# EAGLE design EuroESP32 (EAGLE 9.6.2)
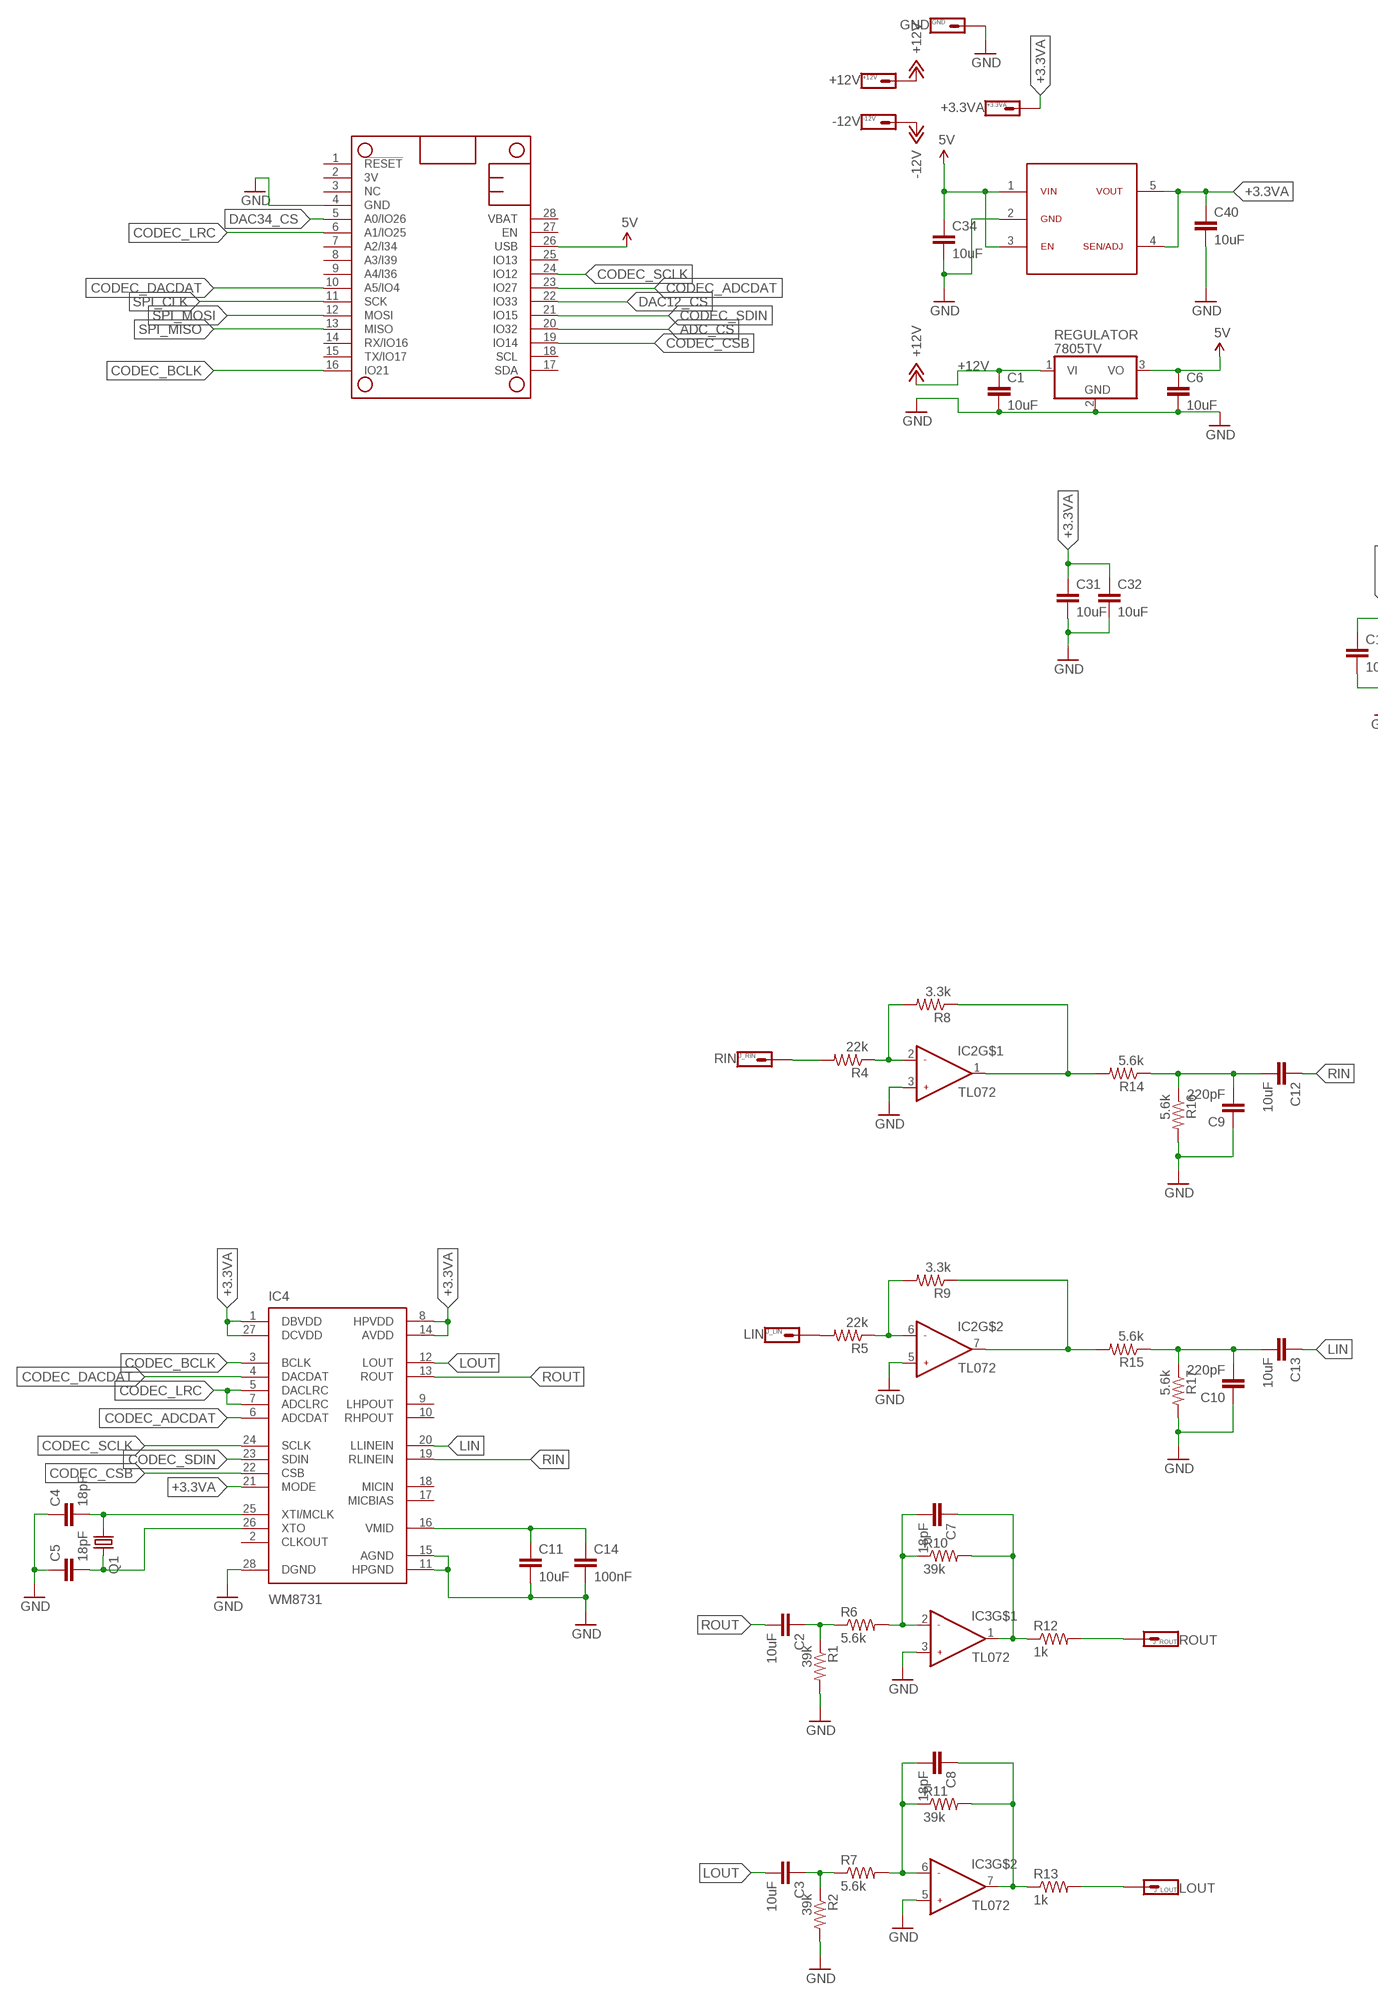
[diagram p0: schematic, sheet 1, part 1 of 2]
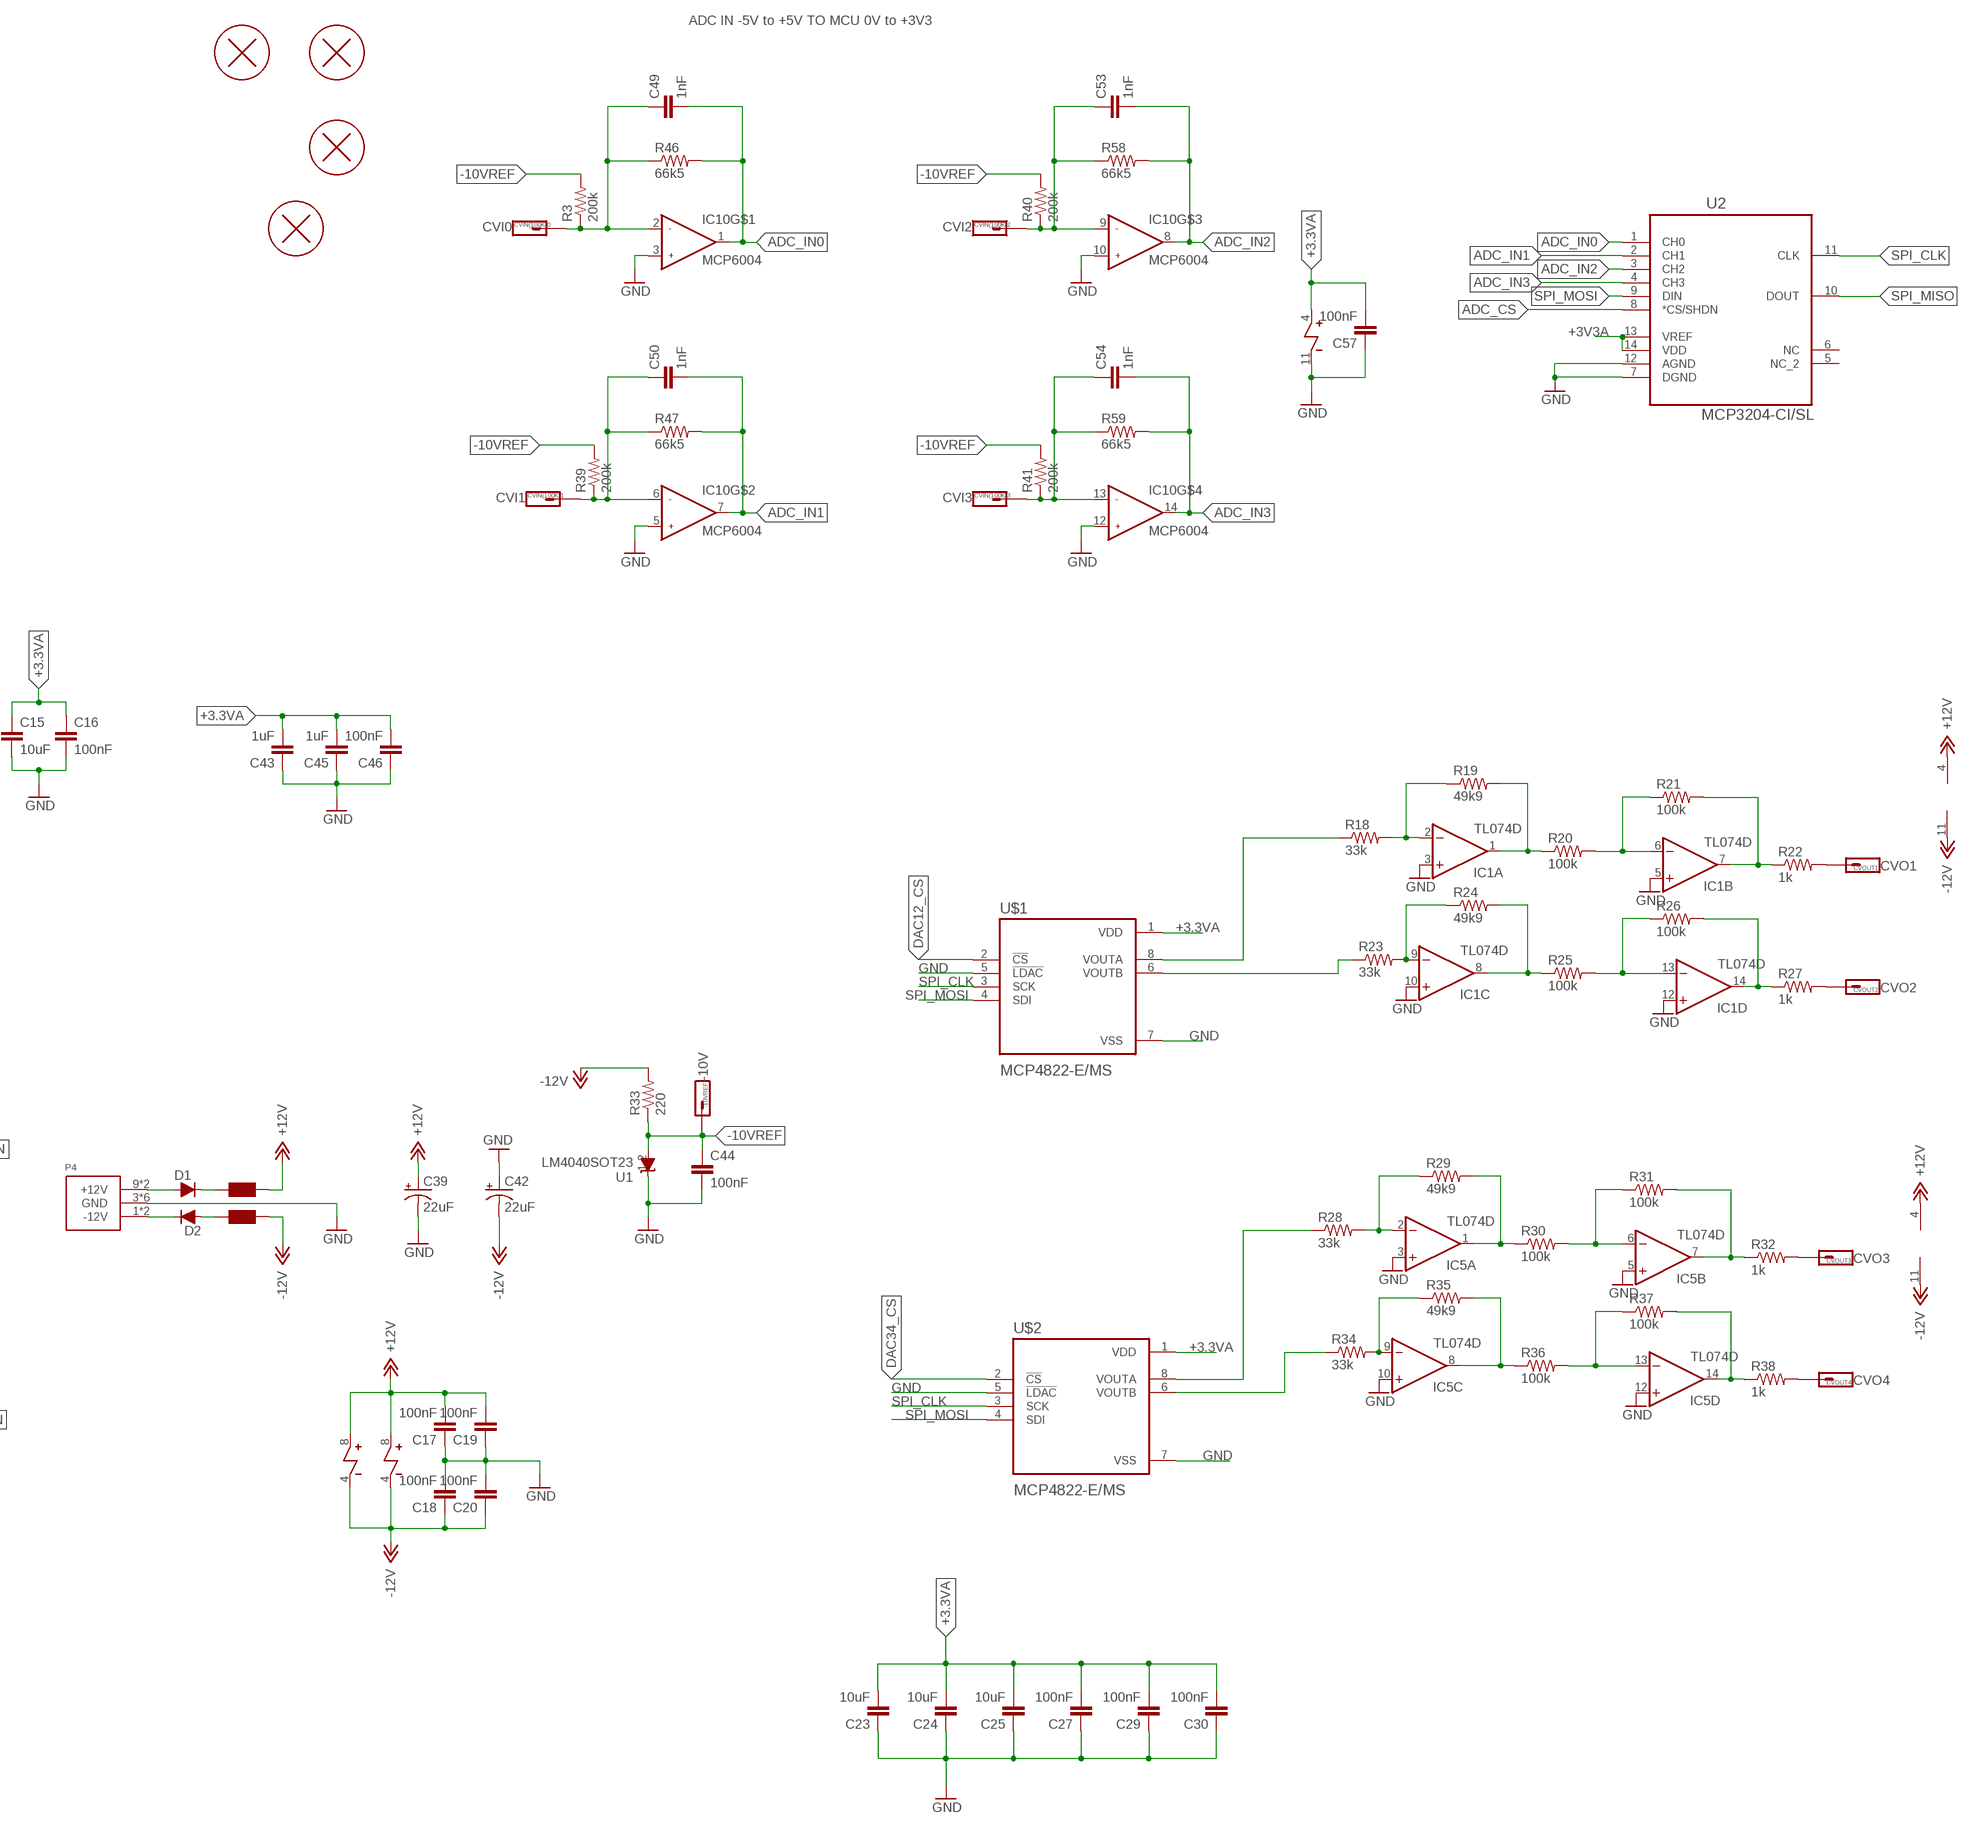
[diagram p1: schematic, sheet 1, part 2 of 2]

## Parts
+3.3VA  +3.3VA  HEADER-1X1  [1X01_SIDE_NAME]
+12V  +12V  HEADER-1X1  [1X01_SIDE_NAME]
-10VREF  -10V  HEADER-1X1  [1X01_SIDE_NAME]
-12V  -12V  HEADER-1X1  [1X01_SIDE_NAME]
C1  10uF  C2.5/2  [C2.5-2]
C2  10uF  CAPACITOR0805  [R0805]
C3  10uF  CAPACITOR0805  [R0805]
C4  18pF  CAPACITOR  [RESISTOR_0603]
C5  18pF  CAPACITOR  [RESISTOR_0603]
C6  10uF  C2.5/2  [C2.5-2]
C7  18pF  CAPACITOR  [RESISTOR_0603]
C8  18pF  CAPACITOR  [RESISTOR_0603]
C9  220pF  CAPACITOR  [RESISTOR_0603]
C10  220pF  CAPACITOR  [RESISTOR_0603]
C11  10uF  CAPACITOR0805  [R0805]
C12  10uF  CAPACITOR0805  [R0805]
C13  10uF  CAPACITOR0805  [R0805]
C14  100nF  CAPACITOR  [RESISTOR_0603]
C15  10uF  CAPACITOR0805  [R0805]
C16  100nF  CAPACITOR  [RESISTOR_0603]
C17  100nF  CAPACITOR  [RESISTOR_0603]
C18  100nF  CAPACITOR  [RESISTOR_0603]
C19  100nF  CAPACITOR  [RESISTOR_0603]
C20  100nF  CAPACITOR  [RESISTOR_0603]
C23  10uF  CAPACITOR0805  [R0805]
C24  10uF  CAPACITOR0805  [R0805]
C25  10uF  CAPACITOR0805  [R0805]
C27  100nF  CAPACITOR  [RESISTOR_0603]
C29  100nF  CAPACITOR  [RESISTOR_0603]
C30  100nF  CAPACITOR  [RESISTOR_0603]
C31  10uF  CAPACITOR0805  [R0805]
C32  10uF  CAPACITOR0805  [R0805]
C34  10uF  CAPACITOR1210  [R1210]
C39  22uF  CAP_POL1206_TANT  [1206_POL]
C40  10uF  CAPACITOR0805  [R0805]
C42  22uF  CAP_POL1206_TANT  [1206_POL]
C43  1uF  CAPACITOR  [RESISTOR_0603]
C44  100nF  CAPACITOR  [RESISTOR_0603]
C45  1uF  CAPACITOR  [RESISTOR_0603]
C46  100nF  CAPACITOR  [RESISTOR_0603]
C49  1nF  CAPACITOR  [RESISTOR_0603]
C50  1nF  CAPACITOR  [RESISTOR_0603]
C53  1nF  CAPACITOR  [RESISTOR_0603]
C54  1nF  CAPACITOR  [RESISTOR_0603]
C57  100nF  CAPACITOR  [RESISTOR_0603]
CVIN(100K)0  CVI0  HEADER-1X1  [1X01_SIDE_NAME]
CVIN(100K)1  CVI1  HEADER-1X1  [1X01_SIDE_NAME]
CVIN(100K)2  CVI2  HEADER-1X1  [1X01_SIDE_NAME]
CVIN(100K)3  CVI3  HEADER-1X1  [1X01_SIDE_NAME]
CVOUT1  CVO1  HEADER-1X1  [1X01_SIDE_NAME]
CVOUT2  CVO2  HEADER-1X1  [1X01_SIDE_NAME]
CVOUT3  CVO3  HEADER-1X1  [1X01_SIDE_NAME]
CVOUT4  CVO4  HEADER-1X1  [1X01_SIDE_NAME]
D1  DIODE  [SOD123]
D2  DIODE  [SOD123]
F1  FERRITE-BEAD0805  [R0805]
F2  FERRITE-BEAD0805  [R0805]
GND  GND  HEADER-1X1  [1X01_SIDE_NAME]
H1  PCB_SCREW  [PCB_SCREW]
H3  PCB_SCREW  [PCB_SCREW]
H4  PCB_SCREW  [PCB_SCREW]
H5  PCB_SCREW  [PCB_SCREW]
IC1  TL074D  [SO14]
IC2  TL072  OPAMP_DUAL  [SOIC8]
IC3  TL072  OPAMP_DUAL  [SOIC8]
IC4  WM8731  [SSOP28]
IC5  TL074D  [SO14]
IC7  ADP7118  [SOT23-5L]
IC10  MCP6004  OPAMP_QUADPWR  [TSSOP14]
J_LIN  LIN  HEADER-1X1  [1X01_SIDE_NAME]
J_LOUT  LOUT  HEADER-1X1  [1X01_SIDE_NAME]
J_RIN  RIN  HEADER-1X1  [1X01_SIDE_NAME]
J_ROUT  ROUT  HEADER-1X1  [1X01_SIDE_NAME]
MS2  FEATHER_HUZZAH32NO_DRILL  [FEATHERWING_NODRILL]
P4  POWER_SIMPLE10  [POWER_10]
Q1  CRYSTAL  [HC49UP]
R1  39k  RESISTOR  [RESISTOR_0603]
R2  39k  RESISTOR  [RESISTOR_0603]
R3  200k  RESISTOR  [RESISTOR_0603]
R4  22k  RESISTOR  [RESISTOR_0603]
R5  22k  RESISTOR  [RESISTOR_0603]
R6  5.6k  RESISTOR  [RESISTOR_0603]
R7  5.6k  RESISTOR  [RESISTOR_0603]
R8  3.3k  RESISTOR  [RESISTOR_0603]
R9  3.3k  RESISTOR  [RESISTOR_0603]
R10  39k  RESISTOR  [RESISTOR_0603]
R11  39k  RESISTOR  [RESISTOR_0603]
R12  1k  RESISTOR  [RESISTOR_0603]
R13  1k  RESISTOR  [RESISTOR_0603]
R14  5.6k  RESISTOR  [RESISTOR_0603]
R15  5.6k  RESISTOR  [RESISTOR_0603]
R16  5.6k  RESISTOR  [RESISTOR_0603]
R17  5.6k  RESISTOR  [RESISTOR_0603]
R18  33k  RESISTOR  [RESISTOR_0603]
R19  49k9  RESISTOR  [RESISTOR_0603]
R20  100k  RESISTOR  [RESISTOR_0603]
R21  100k  RESISTOR  [RESISTOR_0603]
R22  1k  RESISTOR  [RESISTOR_0603]
R23  33k  RESISTOR  [RESISTOR_0603]
R24  49k9  RESISTOR  [RESISTOR_0603]
R25  100k  RESISTOR  [RESISTOR_0603]
R26  100k  RESISTOR  [RESISTOR_0603]
R27  1k  RESISTOR  [RESISTOR_0603]
R28  33k  RESISTOR  [RESISTOR_0603]
R29  49k9  RESISTOR  [RESISTOR_0603]
R30  100k  RESISTOR  [RESISTOR_0603]
R31  100k  RESISTOR  [RESISTOR_0603]
R32  1k  RESISTOR  [RESISTOR_0603]
R33  220  RESISTOR  [RESISTOR_0603]
R34  33k  RESISTOR  [RESISTOR_0603]
R35  49k9  RESISTOR  [RESISTOR_0603]
R36  100k  RESISTOR  [RESISTOR_0603]
R37  100k  RESISTOR  [RESISTOR_0603]
R38  1k  RESISTOR  [RESISTOR_0603]
R39  200k  RESISTOR  [RESISTOR_0603]
R40  200k  RESISTOR  [RESISTOR_0603]
R41  200k  RESISTOR  [RESISTOR_0603]
R46  66k5  RESISTOR  [RESISTOR_0603]
R47  66k5  RESISTOR  [RESISTOR_0603]
R58  66k5  RESISTOR  [RESISTOR_0603]
R59  66k5  RESISTOR  [RESISTOR_0603]
REGULATOR  7805TV  [TO220V]
U1  LM4040SOT23  [SOT23]
U2  MCP3204-CI/SL  [SOIC127P600X175-14N]
U$1  MCP4822-E/MS  [SOP65P490X110-8N]
U$2  MCP4822-E/MS  [SOP65P490X110-8N]

## Nets
5V: C6.1 C34.1 IC7.1 IC7.3 MS2.26(USB) REGULATOR.3(VO)
+3.3VA: +3.3VA.1 C15.1 C16.1 C23.2 C24.2 C25.2 C27.2 C29.2 C30.2 C31.1 C32.1 C40.1 C43.2 C45.2 C46.2 C57.2 IC4.1(DBVDD) IC4.8(HPVDD) IC4.14(AVDD) IC4.21(MODE) IC4.27(DCVDD) IC7.4 IC7.5 IC10.4 U$1.1(VDD) U$2.1(VDD)
+3V3A: U2.13(VREF) U2.14(VDD)
+12V: +12V.1 C1.1 C17.2 C19.2 C39.2(+) F1.1 IC1.4(P:V+) IC2.8 IC3.8 IC5.4(P:V+) REGULATOR.1(VI)
-10VREF: -10VREF.1 C44.1 R3.2 R33.1 R39.2 R40.2 R41.2 U1.2(A)
-12V: -12V.1 C18.1 C20.1 C42.1(-) F2.1 IC1.11(P:V-) IC2.4 IC3.4 IC5.11(P:V-) R33.2
ADC_CS: MS2.20(IO32) U2.8(*CS/SHDN)
ADC_IN0: C49.2 IC10.1 R46.2 U2.1(CH0)
ADC_IN1: C50.2 IC10.7 R47.2 U2.2(CH1)
ADC_IN2: C53.2 IC10.8 R58.2 U2.3(CH2)
ADC_IN3: C54.2 IC10.14 R59.2 U2.4(CH3)
CODEC_ADCDAT: IC4.6(ADCDAT) MS2.23(IO27)
CODEC_BCLK: IC4.3(BCLK) MS2.16(IO21)
CODEC_CSB: IC4.22(CSB) MS2.19(IO14)
CODEC_DACDAT: IC4.4(DACDAT) MS2.10(A5/IO4)
CODEC_LRC: IC4.5(DACLRC) IC4.7(ADCLRC) MS2.6(A1/IO25)
CODEC_SCLK: IC4.24(SCLK) MS2.24(IO12)
CODEC_SDIN: IC4.23(SDIN) MS2.21(IO15)
DAC12_CS: MS2.22(IO33) U$1.2(!CS)
DAC34_CS: MS2.5(A0/IO26) U$2.2(!CS)
DAC_B: R23.1 U$1.6(VOUTB)
DAC_D: R34.1 U$2.6(VOUTB)
GND: C1.2 C4.1 C5.1 C6.2 C9.1 C10.1 C11.2 C14.2 C15.2 C16.2 C17.1 C18.2 C19.1 C20.2 C23.1 C24.1 C25.1 C27.1 C29.1 C30.1 C31.2 C32.2 C34.2 C39.1(-) C40.2 C42.2(+) C43.1 C44.2 C45.1 C46.1 C57.1 GND.1 IC1.3(A:+IN) IC1.5(B:+IN) IC1.10(C:+IN) IC1.12(D:+IN) IC2.3 IC2.5 IC3.3 IC3.5 IC4.11(HPGND) IC4.15(AGND) IC4.28(DGND) IC5.3(A:+IN) IC5.5(B:+IN) IC5.10(C:+IN) IC5.12(D:+IN) IC7.2 IC10.3 IC10.5 IC10.10 IC10.11 IC10.12 MS2.4(GND) P4.3(GND) P4.4(GND) P4.5(GND) P4.6(GND) P4.7(GND) P4.8(GND) R1.2 R2.2 R16.2 R17.2 REGULATOR.2(GND) U1.1(C) U2.7(DGND) U2.12(AGND) U$1.5(!LDAC) U$1.7(VSS) U$2.5(!LDAC) U$2.7(VSS)
LIN: C13.1 IC4.20(LLINEIN)
LOUT: C3.2 IC4.12(LOUT)
N$1: J_LIN.1 R5.2
N$2: J_LOUT.1 R13.2
N$3: J_ROUT.1 R12.2
N$4: IC1.2(A:-IN) R18.2 R19.1
N$5: IC1.7(B:OUT) R21.2 R22.1
N$6: IC1.9(C:-IN) R23.2 R24.1
N$8: IC1.1(A:OUT) R19.2 R20.1
N$9: IC1.14(D:OUT) R26.2 R27.1
N$10: IC5.6(B:-IN) R30.2 R31.1
N$11: IC1.8(C:OUT) R24.2 R25.1
N$12: IC5.2(A:-IN) R28.2 R29.1
N$13: IC5.7(B:OUT) R31.2 R32.1
N$14: IC5.13(D:-IN) R36.2 R37.1
N$15: C53.1 CVIN(100K)2.1 IC10.9 R40.1 R58.1
N$16: IC5.1(A:OUT) R29.2 R30.1
N$17: C49.1 CVIN(100K)0.1 IC10.2 R3.1 R46.1
N$18: IC5.9(C:-IN) R34.2 R35.1
N$19: C50.1 CVIN(100K)1.1 IC10.6 R39.1 R47.1
N$20: IC5.14(D:OUT) R37.2 R38.1
N$21: C54.1 CVIN(100K)3.1 IC10.13 R41.1 R59.1
N$22: IC1.6(B:-IN) R20.2 R21.1
N$23: IC5.8(C:OUT) R35.2 R36.1
N$24: R18.1 U$1.8(VOUTA)
N$25: CVOUT1.1 R22.2
N$26: R28.1 U$2.8(VOUTA)
N$27: CVOUT2.1 R27.2
N$28: IC1.13(D:-IN) R25.2 R26.1
N$29: CVOUT3.1 R32.2
N$31: J_RIN.1 R4.2
N$32: IC2.2 R4.1 R8.2
N$33: D1.+ P4.9(+12V) P4.10(+12V)
N$34: CVOUT4.1 R38.2
N$36: IC2.1 R8.1 R14.2
N$37: C9.2 C12.2 R14.1 R16.1
N$40: IC2.6 R5.1 R9.2
N$42: IC2.7 R9.1 R15.2
N$43: C5.2 IC4.26(XTO) Q1.2
N$44: C4.2 IC4.25(XTI/MCLK) Q1.1
N$45: C10.2 C13.2 R15.1 R17.1
N$46: C7.1 IC3.1 R10.2 R12.1
N$47: D1.- F1.2
N$48: C7.2 IC3.2 R6.2 R10.1
N$49: C2.1 R1.1 R6.1
N$53: D2.- P4.1(-12V) P4.2(-12V)
N$54: C8.1 IC3.7 R11.2 R13.1
N$55: C8.2 IC3.6 R7.2 R11.1
N$56: C11.1 C14.1 IC4.16(VMID)
N$57: C3.1 R2.1 R7.1
N$59: D2.+ F2.2
RIN: C12.1 IC4.19(RLINEIN)
ROUT: C2.2 IC4.13(ROUT)
SPI_CLK: MS2.11(SCK) U2.11(CLK) U$1.3(SCK) U$2.3(SCK)
SPI_MISO: MS2.13(MISO) U2.10(DOUT)
SPI_MOSI: MS2.12(MOSI) U2.9(DIN) U$1.4(SDI) U$2.4(SDI)
Unconnected: IC4.2(CLKOUT) IC4.9(LHPOUT) IC4.10(RHPOUT) IC4.17(MICBIAS) IC4.18(MICIN) MS2.1(!RESET) MS2.2(3V) MS2.3(NC) MS2.7(A2/I34) MS2.8(A3/I39) MS2.9(A4/I36) MS2.14(RX/IO16) MS2.15(TX/IO17) MS2.17(SDA) MS2.18(SCL) MS2.25(IO13) MS2.27(EN) MS2.28(VBAT) U2.5(NC_2) U2.6(NC)

## Notes on the sheet
- ADC IN -5V to +5V TO MCU 0V to +3V3

## Library data of the parts
+3.3VA +12V -10VREF -12V CVIN(100K)0 CVIN(100K)1-CVIN(100K)3 CVOUT1-CVOUT4 GND J_LIN J_LOUT J_RIN J_ROUT = TOF:HEADER-1X1: Header 1 Standard 1-pin 0.1" header. Use with straight break away headers (SKU : PRT-00116), right angle break away headers (PRT-00553), swiss pins (PRT-00743), machine pins (PRT-00117), and female headers (PRT-00115).
C1 C6 = TOF:C: CAPACITOR naming: grid - package width
C2-C5 C7-C20 C23-C25 C27 C29-C32 C34 C40 C43-C46 C49 C50 C53 C54 C57 = parts_aman:CAPACITOR
C39 C42 = parts_aman:CAP_POL
D1 D2 = parts_aman:DIODE
F1 F2 = parts_aman:FERRITE-BEAD
H1 H3-H5 = parts_aman:PCB_SCREW
IC1 IC5 = linear:TL074: OP AMP
IC2 IC3 = parts_aman:OPAMP_DUAL
IC4 = og-dac:WM8731
IC7 = parts_aman:ADP7118
IC10 = parts_aman:OPAMP_QUAD
MS2 = TOF:FEATHER_HUZZAH32
P4 = parts_aman:POWER_SIMPLE
Q1 = parts_aman:CRYSTAL
R1-R41 R46 R47 R58 R59 = parts_aman:RESISTOR
REGULATOR = linear:78*: Positive VOLTAGE REGULATOR Source: http://cache.national.com/ds/LM/LM78L05.pdf http://www.fairchildsemi.com/ds/LM/LM7805.pdf
U1 = parts_aman:LM4040
U2 = TOF:MCP3204-CI/SL: IC ADC 12BIT 2.7V 4CH SPI; MPN: MCP3204-CI/SL; OC_FARNELL: 1196795; OC_NEWARK: 26M1276; PACKAGE: 14 - SOIC; SUPPLIER: Microchip
U$1 U$2 = TOF:MCP4822-E/MS: Check prices <https://pricing.snapeda.com/parts/MCP4822-E/MS/Microchip%20Technology/view-part?ref=eda>; AVAILABILITY: Warning; DESCRIPTION: 12 Bit Digital to Analog Converter 2 8-MSOP; MF: Microchip Technology; MP: MCP4822-E/MS; PACKAGE: MSOP-8 Microchip; PRICE: None; PURCHASE-URL: https://pricing.snapeda.com/search/part/MCP4822-E/MS/?ref=eda

## Board
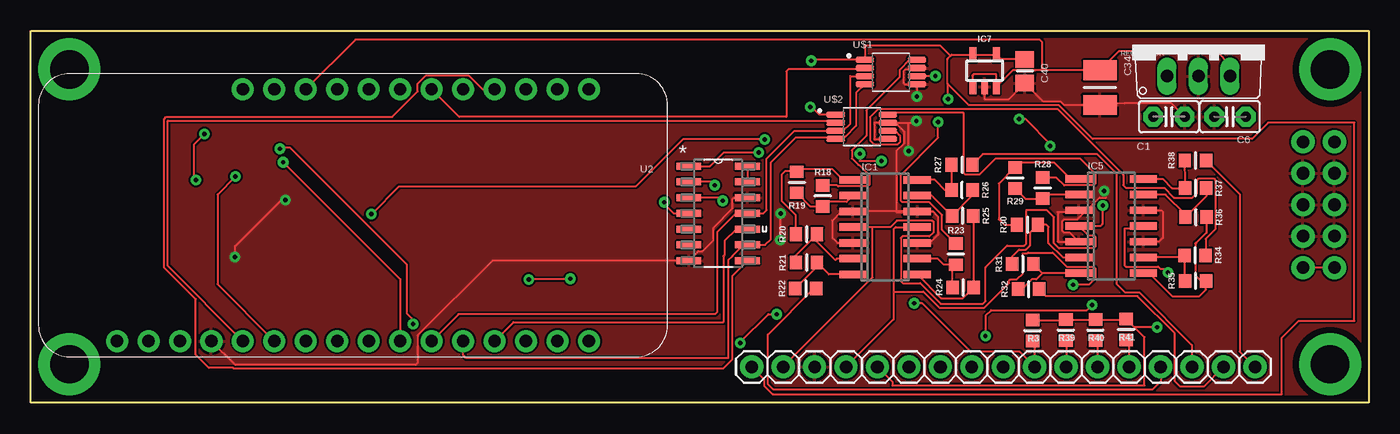
[diagram p2: board, top side]
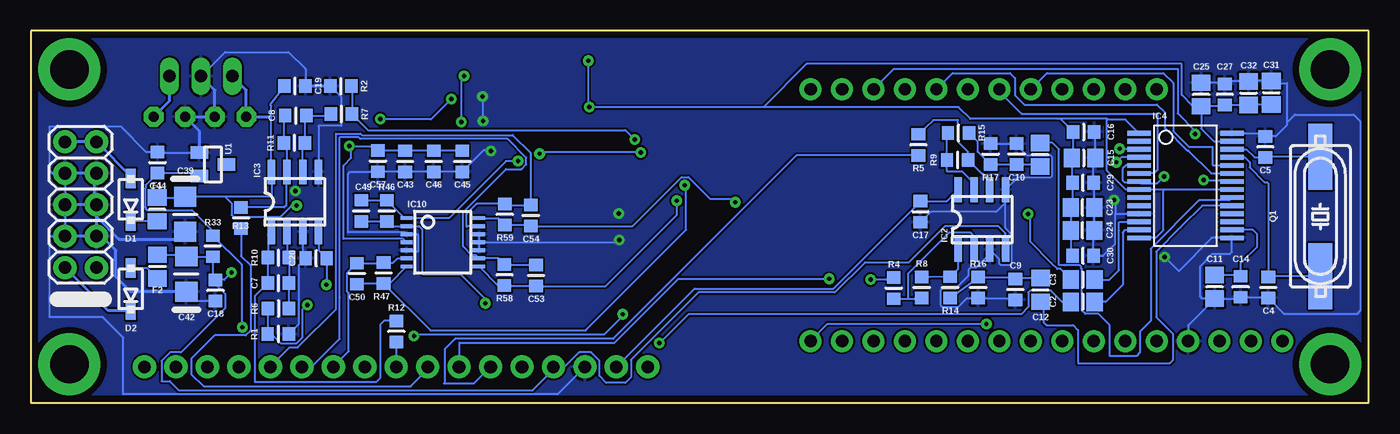
[diagram p3: board, bottom side, seen from below]

Size 108 x 30 mm. Coordinates in mm from the lower left corner, seen from the top.
Outline: 0,0 0,30 108,30 108,0 0,0
Copper layers (1*16): Top 0.035mm / dielectric 1.5mm / Bottom 0.035mm
Design rules "PCBCart-Standard *": minimum track width 6mil, minimum drill 12mil, track to track 6mil, track to pad 6mil, pad to pad 6mil, via to via 6mil, smd to smd 6mil, copper to edge 20mil, drill to drill 8mil, minimum pad ring 8mil, minimum via ring 10mil, stop-mask expansion 3mil, vias tented up to drill 25mil, thermal gap 8mil

### Footprints (pad centres in the part's own frame; a part is rotated, then mirrored left to right if it is on the bottom)
1X01_SIDE_NAME = drill 1.016 pad 1.88: 1 0,0
C2.5-2 = drill 0.813 pad 1.6 octagon: 1 -1.27,0; 2 1.27,0
R0805 = smd 1.3 x 1.5: 1 -0.95,0; 2 0.95,0
RESISTOR_0603 = smd 1 x 1.1: 1 -0.85,0; 2 0.85,0
R1210 = smd 1.6 x 2.7: 1 -1.4,0; 2 1.4,0
1206_POL = smd 1.6 x 1.803: 1 -1.422,0; 2 1.422,0
SOD123 = smd 1.6 x 0.8: + 1.7,0; - -1.7,0
PCB_SCREW = drill 3.1 pad 5: P$1 0,0
SO14 = smd 0.6 x 2.2: 1 -3.81,-2.6; 2 -2.54,-2.6; 3 -1.27,-2.6; 4 0,-2.6; 5 1.27,-2.6; 6 2.54,-2.6; 7 3.81,-2.6; 8 3.81,2.6; 9 2.54,2.6; 10 1.27,2.6; 11 0,2.6; 12 -1.27,2.6; 13 -2.54,2.6; 14 -3.81,2.6
SOIC8 = smd 0.6 x 2: 1 -1.905,-2.419; 2 -0.635,-2.419; 3 0.635,-2.419; 4 1.905,-2.419; 5 1.905,2.42; 6 0.635,2.42; 7 -0.635,2.42; 8 -1.905,2.42
SSOP28 = smd 0.381 x 1.905: 1 -4.55,-3.752; 2 -3.9,-3.752; 3 -3.25,-3.752; 4 -2.6,-3.752; 5 -1.95,-3.752; 6 -1.3,-3.752; 7 -0.65,-3.752; 8 0,-3.752; 9 0.65,-3.752; 10 1.3,-3.752; 11 1.95,-3.752; 12 2.6,-3.752; 13 3.25,-3.752; 14 3.9,-3.752; 15 3.9,3.752; 16 3.25,3.752; 17 2.6,3.752; 18 1.95,3.752; 19 1.3,3.752; 20 0.65,3.752; 21 0,3.752; 22 -0.65,3.752; 23 -1.3,3.752; 24 -1.95,3.752; 25 -2.6,3.752; 26 -3.25,3.752; 27 -3.9,3.752; 28 -4.55,3.752
SOT23-5L = smd 0.55 x 1.2: 1 -0.95,-1.3; 2 0,-1.3; 3 0.95,-1.3; 4 0.95,1.3; 5 -0.95,1.3
TSSOP14 = smd 0.305 x 0.991: 1 -1.95,-2.918; 2 -1.3,-2.918; 3 -0.65,-2.918; 4 0,-2.918; 5 0.65,-2.918; 6 1.3,-2.918; 7 1.95,-2.918; 8 1.95,2.918; 9 1.3,2.918; 10 0.65,2.918; 11 0,2.918; 12 -0.65,2.918; 13 -1.3,2.918; 14 -1.95,2.918
FEATHERWING_NODRILL = drill 1 pad 1.778: 1 6.35,1.27; 2 8.89,1.27; 3 11.43,1.27; 4 13.97,1.27; 5 16.51,1.27; 6 19.05,1.27; 7 21.59,1.27; 8 24.13,1.27; 9 26.67,1.27; 10 29.21,1.27; 11 31.75,1.27; 12 34.29,1.27; 13 36.83,1.27; 14 39.37,1.27; 15 41.91,1.27; 16 44.45,1.27; 17 44.45,21.59; 18 41.91,21.59; 19 39.37,21.59; 20 36.83,21.59; 21 34.29,21.59; 22 31.75,21.59; 23 29.21,21.59; 24 26.67,21.59; 25 24.13,21.59; 26 21.59,21.59; 27 19.05,21.59; 28 16.51,21.59
POWER_10 = drill 1.016 pad 1.88: 1 -5.08,-1.27; 2 -5.08,1.27; 3 -2.54,-1.27; 4 -2.54,1.27; 5 0,-1.27; 6 0,1.27; 7 2.54,-1.27; 8 2.54,1.27; 9 5.08,-1.27; 10 5.08,1.27
HC49UP = smd 5.334 x 1.93: 1 -4.826,0; 2 4.826,0
TO220V = drill 1.016 long: 1 -2.54,-2.54; 2 0,-2.54; 3 2.54,-2.54
SOT23 = smd 1 x 1.4: 1 -0.95,-1.1; 2 0.95,-1.1; 3 0,1.1
SOIC127P600X175-14N = smd 1.981 x 0.559: 1 -2.362,3.81; 2 -2.362,2.54; 3 -2.362,1.27; 4 -2.362,0; 5 -2.362,-1.27; 6 -2.362,-2.54; 7 -2.362,-3.81; 8 2.362,-3.81; 9 2.362,-2.54; 10 2.362,-1.27; 11 2.362,0; 12 2.362,1.27; 13 2.362,2.54; 14 2.362,3.81
SOP65P490X110-8N = smd 1.5 x 0.49: 1 -2.105,0.975; 2 -2.105,0.325; 3 -2.105,-0.325; 4 -2.105,-0.975; 5 2.105,-0.975; 6 2.105,-0.325; 7 2.105,0.325; 8 2.105,0.975

### Placement (x,y rotation side)
+3.3VA  58.19,2.89 90 top
+12V  60.73,2.89 90 top
-10VREF  68.35,2.89 90 top
-12V  65.81,2.89 90 top
C1  91.88,23.08 0 top
C2  23.07,8.14 0 bottom
C3  23.07,9.93 0 bottom
C4  8.1,9.3 90 bottom
C5  8.34,20.64 270 bottom
C6  96.81,23.08 180 top
C7  88.03,9.65 0 bottom
C8  86.62,23.16 0 bottom
C9  28.52,9.14 90 bottom
C10  28.42,20.06 270 bottom
C11  12.43,9.36 270 bottom
C12  26.49,9.11 90 bottom
C13  26.51,20.01 270 bottom
C14  10.32,9.36 270 bottom
C15  23,19.75 0 bottom
C16  23,21.85 0 bottom
C17  36.18,15.41 90 bottom
C18  93.11,9.06 270 bottom
C19  86.68,25.55 180 bottom
C20  84.97,11.65 180 bottom
C23  23.1,15.75 180 bottom
C24  23.1,13.91 180 bottom
C25  13.51,24.88 270 bottom
C27  11.61,24.88 270 bottom
C29  23.05,17.75 180 bottom
C30  23.05,11.86 180 bottom
C31  7.86,25.02 90 bottom
C32  9.69,24.98 90 bottom
C34  86.32,25.43 270 top
C39  95.55,15.21 90 bottom
C40  80.25,26.75 270 top
C42  95.45,10.38 270 bottom
C43  77.79,19.48 90 bottom
C44  97.78,19.38 90 bottom
C45  73.18,19.48 90 bottom
C46  75.48,19.48 90 bottom
C49  81.33,15.49 90 bottom
C50  81.68,10.41 270 bottom
C53  67.21,10.26 270 bottom
C54  67.64,15.09 270 bottom
C57  80,19.49 90 bottom
CVIN(100K)0  81.05,2.89 90 top
CVIN(100K)1  83.59,2.89 90 top
CVIN(100K)2  86.13,2.89 90 top
CVIN(100K)3  88.67,2.89 90 top
CVOUT1  91.21,2.89 90 top
CVOUT2  93.75,2.89 90 top
CVOUT3  96.29,2.89 90 top
CVOUT4  98.83,2.89 90 top
D1  99.94,16.39 90 bottom
D2  99.94,9.18 90 bottom
F1  97.81,15.61 270 bottom
F2  97.8,10.97 270 bottom
GND  63.27,2.89 90 top
H1  104.9,26.9 0 top
H3  3.1,3.1 0 top
H4  104.9,3.1 0 top
H5  3.1,26.9 0 top
IC1  68.96,14.17 270 top
IC2  31.21,14.77 0 bottom
IC3  86.7,16.2 0 bottom
IC4  14.78,17.2 270 bottom
IC5  87.22,14.26 270 top
IC7  77,26.8 0 top
IC10  74.75,12.95 270 bottom
J_LIN  70.89,2.89 90 top
J_LOUT  75.97,2.89 90 top
J_RIN  73.43,2.89 90 top
J_ROUT  78.51,2.89 90 top
MS2  0.6,3.7 0 top
P4  103.97,15.97 90 bottom
Q1  3.89,15.04 90 bottom
R1  88.04,5.54 0 bottom
R2  82.98,25.55 180 bottom
R3  80.89,5.82 90 top
R4  38.34,9.24 90 bottom
R5  36.34,20.81 270 bottom
R6  88.02,7.59 0 bottom
R7  82.93,23.29 180 bottom
R8  36.08,9.29 270 bottom
R9  33.19,19.59 0 bottom
R10  88.02,11.7 180 bottom
R11  86.72,20.97 180 bottom
R12  78.49,5.75 270 bottom
R13  91.04,14.9 270 bottom
R14  33.77,9.31 90 bottom
R15  33.11,21.77 180 bottom
R16  31.52,9.29 270 bottom
R17  30.52,20.06 90 bottom
R18  63.93,16.68 270 top
R19  61.84,17.79 90 top
R20  62.62,13.6 0 top
R21  62.62,11.31 0 top
R22  62.57,9.22 0 top
R23  74.68,11.98 270 top
R24  75.27,9.3 0 top
R25  75.23,15.08 180 top
R26  75.18,17.16 180 top
R27  75.17,19.21 0 top
R28  81.69,17.32 270 top
R29  79.46,18.14 90 top
R30  80.46,14.36 0 top
R31  80.09,11.19 0 top
R32  80.54,9.16 0 top
R33  93.32,12.62 270 bottom
R34  93.99,11.89 180 top
R35  94.03,9.83 0 top
R36  94.06,14.97 180 top
R37  94.04,17.32 180 top
R38  94.02,19.55 0 top
R39  83.57,5.86 90 top
R40  85.95,5.86 90 top
R41  88.43,5.91 90 top
R46  79.28,15.49 90 bottom
R47  79.53,10.46 270 bottom
R58  69.77,10.31 270 bottom
R59  69.73,15.19 270 bottom
REGULATOR  94.27,28.89 0 top
U1  93.31,19.23 270 bottom
U2  55.49,15.28 0 top
U$1  69.43,26.69 0 top
U$2  67.08,22.27 0 top

### Tracks (layer width: path | path; a pad name or v marks a point on that pad's centre or on a via)
5V
  Top 0.152: REGULATOR.3 96.81,27.29 95.75,28.35 87.84,28.35 C34.1 81.65,26.83 | 81.65,26.83 81.1,26.83 81.09,26.82 79.27,26.82 IC7.3 77.95,26.5 76.1,26.5 76,26.4 76,25.54 IC7.1 | 81.65,26.83 81.65,29.1 81.45,29.3 26.2,29.3 MS2.26
  Bottom 0.254: C6.1 96.81,24.35 REGULATOR.3
+3.3VA  (via drill 0.35)
  Top 0.152: C40.1 78.34,27.7 IC7.4 IC7.5 74.35,28.1 74.25,28 | +3.3VA.1 59.2,1.89 59.2,1.37 59.88,0.69 101,0.69 101,5.25 102.35,6.6 106.85,6.6 106.85,22.6 99.9,22.6 98.6,21.3 85.71,21.3 82.99,24.02 75.73,24.02 74,25.75 | 74,25.75 74,27.75 74.25,28 | 74.25,28 73.45,28.8 67.35,28.8 67.33,28.78 U$1.1 63.26,27.66 63.15,27.55 63.05,27.55 v63,27.6 | U$2.1 63.66,23.24 63.05,23.85 v62.93,23.85 | 74,25.75 74,24.9 74.06,24.84 v74.06,24.5 | v79.8,22.9 80.28,22.9 82.36,20.82 82.36,20.79 v82.28,20.71
  Bottom 0.152: C31.1 9.64,24.07 C32.1 C27.2 11.71,23.93 C25.2 | C25.2 13.51,22.11 12.5,21.1 IC4.27 | C30.2 24.05,12.01 C24.2 C23.2 23.9,15.9 C29.2 23.95,17.8 C15.1 23.85,19.86 C16.1 24.9,22.9 25.1,22.9 | C45.2 C46.2 C43.2 C57.2 80.37,20.71 v82.28,20.71 82.14,20.57 82.14,19.76 82.76,19.14 82.76,13.21 77.94,13.21 IC10.4 | 25.1,22.9 32.15,22.9 33.1,23.85 48.86,23.85 | 48.86,23.85 v62.93,23.85 63,23.92 v63,27.6 | v74.06,24.5 75.7,22.86 79.76,22.86 v79.8,22.9 | IC4.14 17.18,13.3 16.56,13.92 16.56,17.14 16.62,17.2 | IC4.21 16.62,17.2 | 16.62,17.2 IC4.8 19.6,17.2 21.12,18.72 21.12,22.84 | 21.12,22.84 21.12,22.92 25.08,22.92 25.1,22.9 | 21.12,22.84 19.62,22.84 IC4.1 | C25.2 14.17,23.93 15.08,24.84 15.08,27.34 45.37,27.34 48.86,23.85
+3V3A
  Top 0.152: U2.14 U2.13
+12V  (via drill 0.35)
  Top 0.152: +12V.1 67.95,10.11 67.95,14.15 67.93,14.17 IC1.4 69.39,14.17 69.92,14.7 72.75,14.7 72.89,14.56 72.89,13.77 72.54,13.43 70.36,13.43 70.23,13.29 70.23,9.96 70.26,9.94 70.26,9.78 70.4,9.64 71.8,9.64 73.46,7.98 76.86,7.98 77.08,8.2 77.08,10.93 78.82,12.66 80.2,12.66 80.33,12.8 80.33,15.52 82.04,15.52 82.59,14.97 82.59,12.87 83.01,12.46 85.81,12.46 85.95,12.59 85.95,13.38 85.81,13.52 85.36,13.52 IC5.4 86.36,14.26 86.5,14.4 86.5,15.85 v86.55,15.9
  Bottom 0.152: F1.1 95.62,16.55 C39.2 95.52,16.65 92.35,16.65 | C17.2 36.15,16.26 | 36.15,16.26 34.05,16.26 IC2.8 | C19.2 88.65,24.07 88.65,24 88.6,23.95 88.6,23.1 IC3.8 88.55,18.57 88.55,16.65 92.35,16.65 | +12V.1 54.42,9.2 43.21,9.2 36.15,16.26 | 92.35,16.65 91.81,16.11 91.81,15.16 91.68,15.02 87.85,15.02 86.97,15.9 v86.55,15.9
  Bottom 0.254: REGULATOR.1 90.61,25.23 C1.1 88.62,23.08 88.6,23.1
-10VREF  (via drill 0.35)
  Top 0.152: R3.2 83.52,6.67 R39.2 R40.2 88.38,6.71 R41.2 89.11,6.08 | -10VREF.1 69.55,1.69 69.55,1.41 89.9,1.41 89.9,5.29 89.11,6.08 | v90.94,6.08 89.11,6.08
  Bottom 0.152: U1.2 94.66,18.53 C44.1 98.75,17.56 98.75,17.33 98.78,17.3 98.78,15.81 98.75,15.78 98.75,15.65 98.65,15.55 95,15.55 93.32,13.87 R33.1 91,11.15 91,6.15 v90.94,6.08
-12V  (via drill 0.35)
  Top 0.152: -12V.1 69.65,6.73 69.65,8.96 | 69.65,8.96 69.65,14 69.82,14.17 IC1.11 | IC5.11 89.61,14.05 88.3,14.05 88.3,11.1 88.42,10.98 91.02,10.98 91.19,10.8 91.75,10.8 91.8,10.75 v91.8,10.5 | 69.65,8.96 72.05,8.96 73.33,7.67 76.99,7.67 78.96,9.65 78.96,9.81 79.1,9.94 79.6,9.94 80.08,10.42 80.08,12.02 80.12,12.06 80.45,12.06 80.5,12.1 82.51,12.1 83.63,10.98 85.81,10.98 85.95,10.84 85.95,10.05 85.42,9.52 v84.14,9.52
  Bottom 0.152: F2.1 95.58,11.93 C42.1 95.43,11.78 R33.2 93.32,10.12 C18.1 | IC2.4 29.31,13.66 29.9,14.25 34.2,14.25 37.15,11.3 40.68,11.3 43.09,8.89 54.1,8.89 59.55,3.45 59.55,2.05 60,1.6 61.55,1.6 62.1,2.15 62.1,3.37 62.79,4.06 63.75,4.06 64.92,2.89 65.6,2.89 | v91.8,10.5 92.39,9.91 C18.1 | 65.6,2.89 -12V.1 | C18.1 93.11,9.58 92.33,8.8 92.33,7.61 95.89,4.06 96.77,4.06 97.46,3.37 97.46,1.74 96.79,1.74 96.05,1 67.49,1 65.6,2.89 | IC3.4 84.79,12.32 C20.1 84.12,9.54 v84.14,9.52
ADC_CS
  Top 0.152: U2.8 56.6,10.22 56.6,3.47 55.88,2.75 16.37,2.75 16.31,2.8 14.35,2.8 13.3,3.85 13.3,8.35 10.74,10.91 10.74,22.89 10.92,23.07 29.17,23.07 31.23,25.13 31.23,25.75 31.89,26.41 35.35,26.41 36.47,25.29 MS2.20
ADC_IN0  (via drill 0.35)
  Top 0.152: U2.1 54.84,19.09 55.95,20.2 v58.75,20.2 | v66.93,20.09 66.93,19.5 v68.67,19.5
  Bottom 0.152: C49.2 R46.2 77.84,14.9 IC10.1 74.25,14.9 69.65,19.5 v68.67,19.5 | v58.75,20.2 66.82,20.2 v66.93,20.09
ADC_IN1  (via drill 0.35)
  Top 0.152: v55.2,17.55 54.93,17.82 U2.2
  Bottom 0.152: R47.2 79.06,9.61 IC10.7 | R47.2 75.75,5.83 63.22,5.83 55.1,13.95 55.1,17.45 v55.2,17.55 | R47.2 81.63,9.61 C50.2
ADC_IN2  (via drill 0.35)
  Top 0.152: v55.85,16.3 55.6,16.55 U2.3
  Bottom 0.152: IC10.8 70.29,9.46 R58.2 69.72,9.41 C53.2 61.59,9.41 55.85,15.15 v55.85,16.3
ADC_IN3  (via drill 0.35)
  Top 0.152: v51.14,16.18 51.28,16.04 51.28,15.88 51.88,15.28 U2.4
  Bottom 0.152: IC10.14 70.28,14.9 R59.2 67.74,14.34 C54.2 59.44,14.24 55.47,18.21 54.93,18.21 53.18,16.46 51.14,16.46 v51.14,16.18
CODEC_ADCDAT
  Bottom 0.152: MS2.23 29.81,25.11 28.02,23.32 17.07,23.32 17.07,18.76 17.33,18.5 IC4.6
CODEC_BCLK  (via drill 0.35)
  Top 0.152: v20.1,20.49 20.2,20.59 20.92,20.59 30.35,11.16 30.35,7.2 30.85,6.7 v30.85,6.35
  Bottom 0.152: IC4.3 19.75,20.45 19.89,20.59 20,20.59 v20.1,20.49 | MS2.16 43.67,6.35 v30.85,6.35
CODEC_CSB  (via drill 0.35)
  Top 0.152: v14.02,21.68 13.15,20.82 13.15,18.13 v13.31,17.97
  Bottom 0.152: MS2.19 38.31,26.95 15.4,26.95 15.4,23.35 14.02,21.96 v14.02,21.68 | v13.31,17.97 11.15,17.97 IC4.22
CODEC_DACDAT  (via drill 0.35)
  Top 0.152: v20.36,19.4 v20.37,19.41 29.81,9.97 MS2.10
  Bottom 0.152: v20.36,19.4 19.96,19.8 IC4.4
CODEC_LRC  (via drill 0.35)
  Top 0.152: v16.52,18.26 15.06,16.8 15.06,9.56 MS2.6
  Bottom 0.152: IC4.5 19.57,19.15 19.86,18.86 19.86,17.96 19.7,17.8 18.58,17.8 IC4.7 18.4,17.72 17.06,17.72 v16.52,18.26
CODEC_SCLK
  Bottom 0.152: IC4.24 12.55,19.15 12.6,19.2 12.6,20.65 14.5,20.65 15.77,21.92 15.77,25.82 16.55,26.6 25.96,26.6 MS2.24
CODEC_SDIN
  Bottom 0.152: MS2.21 33.58,26.6 28.95,26.6 28.55,26.2 28.55,24.8 27.8,24.05 17.09,24.05 16.46,23.42 16.46,22.18 14.63,20.34 14.54,20.34 12.7,18.5 IC4.23
DAC12_CS
  Top 0.152: MS2.22 34.57,23.07 60.99,23.07 60.99,26.74 61.15,26.9 67.22,26.9 U$1.2
DAC34_CS
  Top 0.152: MS2.5 11.05,11.03 11.05,22.77 64.8,22.77 U$2.2
DAC_B  (via drill 0.35)
  Top 0.152: R23.1 73.56,13.96 73.56,15.17 72.54,16.18 70.36,16.18 70.23,16.31 70.23,18.37 73.25,21.39 v73.25,22.66 | v73.03,26.38 73.01,26.36 U$1.6
  Bottom 0.152: v73.25,22.66 73.25,26.3 73.1,26.45 v73.03,26.38
DAC_D
  Top 0.152: R34.1 94.84,13.21 95.64,14.01 95.64,17.95 95.49,18.1 94.3,18.1 94.17,17.96 94.17,16.92 93.79,16.54 92.29,16.54 91.5,17.33 88.41,17.33 88.19,17.55 88.19,18.39 82.87,23.71 68.42,23.71 67.8,23.09 67.8,21.12 68.1,20.82 69.96,20.82 70.17,21.02 70.17,21.56 69.79,21.94 U$2.6
GND  (via drill 0.35)
  Top 0.152: v16.48,11.77 16.48,12.62 20.2,16.35 v20.55,16.35 | IC1.3 66.3,15.44 | 66.3,15.44 65.44,15.44 64.7,14.7 64.7,13.3 65.1,12.9 IC1.5 | IC1.12 72.81,15.44 73.25,15 73.25,13.55 72.6,12.9 IC1.10 | IC5.3 84.49,15.4 82.9,15.4 82.9,13 82.91,12.99 IC5.5 83.88,13.73 83.42,13.73 83.29,13.86 83.29,14.65 83.42,14.79 84.51,14.79 86.28,16.56 86.82,16.56 | U$2.7 68.15,22.59 | 68.15,22.59 68.11,22.59 68.1,22.6 | 68.15,22.59 68.1,22.54 68.1,21.25 69.15,21.25 U$2.5 | U$1.7 71.38,26.85 70.56,26.85 70.45,26.74 70.45,25.8 70.54,25.71 U$1.5 v71.54,24.7 | U$2.7 69.36,22.41 69.96,22.41 70.47,21.9 70.47,20.9 69.9,20.32 69.9,15.4 69.95,15.35 71.47,15.35 IC1.12 | IC1.12 67.06,15.44 67.05,15.45 66.31,15.45 66.3,15.44 | MS2.4 16.49,3.05 31.05,3.05 31.23,3.23 31.23,5.43 37.26,11.47 U2.7 53.89,12.23 54.22,12.23 55.09,13.11 55.09,14.11 56.66,15.68 56.66,16.46 56.75,16.55 U2.12 | IC5.12 91.27,15.53 91.4,15.4 91.4,13.3 91.09,12.99 IC5.10 | C1.2 92.08,24.15 88.29,24.15 86.45,24.04 | 86.45,24.04 C34.2 | IC7.2 77,24.5 78.95,24.5 C40.2 81.72,24.32 83.12,24.32 83.41,24.04 86.45,24.04 | v71.5,22.73 71.36,22.59 70.82,22.59 | U$2.7 70.82,22.59 | v70.86,20.32 70.86,22.55 70.82,22.59 | v60.5,13.14 60.5,15.28 60.52,15.3 v60.55,15.27
  Bottom 0.152: C25.1 11.71,25.83 C27.1 11.41,25.93 C32.2 9.64,25.96 C31.2 7.69,25.8 6.6,25.8 6.6,22.6 | 6.6,22.6 6.6,22.4 7.5,21.5 C5.1 8.59,21.75 IC4.28 | C11.2 14.57,6.26 MS2.4 | C11.2 10.43,8.4 C14.2 8.15,8.51 C4.1 6.8,7.15 0.95,7.15 0.66,7.44 0.66,22.7 1.21,23.25 5.95,23.25 6.6,22.6 | C11.2 13.4,8.4 13.6,8.6 13.6,11 12.6,12 11.2,12 11.03,12.17 IC4.15 12.65,13.3 15.33,10.62 v16.48,11.77 | U1.1 97.73,20.18 C44.2 98.68,20.23 100.75,22.3 106.49,22.3 106.49,18.75 106.25,18.52 105.5,18.52 P4.8 P4.6 105.24,15.85 P4.4 105.6,13.44 106.49,13.44 106.49,6.9 102.2,6.9 100.55,5.25 100.55,0.67 65.49,0.67 GND.1 | C42.2 94.71,8.21 C18.2 | C9.1 28.67,8.44 R16.2 32.42,8.44 33.13,7.73 34.42,7.73 34.55,7.86 34.55,9.05 34.42,9.19 33.37,9.19 32.3,10.26 32.3,10.74 32.17,10.87 31.71,10.87 30.58,12 IC2.3 29.84,11.61 29.84,11.26 29.7,11.13 28.91,11.13 28.78,11.26 28.78,13.56 29.31,14.09 29.31,16.14 | R17.2 28.5,20.91 | 28.5,20.91 C10.1 | 20.45,15.25 20.45,14.68 20.46,14.67 20.46,12.84 21.45,11.86 C30.1 22.2,13.86 C24.1 C23.1 22.15,17.7 C29.1 22.2,19.61 C15.2 22.05,21.75 C16.2 | 20.45,15.25 IC4.11 | v20.55,16.35 20.45,16.25 20.45,15.25 | 29.31,16.14 IC2.5 28.32,18.18 25.67,18.18 25.53,18.32 25.53,19.81 25.67,19.94 27.53,19.94 28.5,20.91 | C17.1 35.34,15.4 30.05,15.4 29.31,16.14 | C57.1 C43.1 C46.1 C45.1 71.41,20.4 70.94,20.4 v70.86,20.32 | C57.1 | IC10.5 77.57,12.2 76.75,12.2 76.75,13.55 76.8,13.6 IC10.3 77.82,13.75 82.4,13.75 82.4,18.45 82.22,18.63 C57.1 | 86.06,12.86 IC3.3 86.06,11.85 85.81,11.6 C20.2 86.4,11.07 86.4,6.32 R1.2 | R2.2 82.95,24.67 82.95,22.35 84.79,22.35 IC3.5
  Bottom 0.152: v71.54,24.7 71.54,22.79 71.5,22.75 v71.5,22.73 | REGULATOR.2 92.32,28.3 87.2,28.3 85.83,26.93 C19.1 | IC10.12 IC10.11 | IC10.11 IC10.10 | IC10.11 60.79,12.95 60.56,13.18 60.54,13.18 v60.5,13.14 | v60.55,15.27 60.52,15.24 60.52,15.22
  Bottom 0.254: C1.2 93.15,23.15 | 93.15,23.15 93.15,25.23 REGULATOR.2 | 93.15,23.15 93.22,23.08 C6.2 94.41,21.95 U1.1 | P4.5 102.7,15 100.9,13.2 96.13,13.2 C39.1 | R2.2 C19.1 | P4.7 102.85,18.52 | 102.85,18.52 105.5,18.52 | P4.5 102.9,15.97 | 102.9,15.97 105.12,15.97 105.24,15.85 | P4.5 102.85,16.12 102.85,18.52 | P4.3 102.7,15.78 102.9,15.97 | P4.3 105.6,13.44 | C42.2 99.95,8.95 101.15,10.15 101.15,12.3 102.28,13.44 P4.3
  other vias: 86.64,17.08
  pour Top: 0,30 0,0.1 0,0 108,0 108.1,-0.1 108.1,29.95 108,30
  pour Bottom: 0,30 108.05,30 108.05,0.05 108,0 0,0
LIN
  Bottom 0.152: IC4.20 11.26,16.32 13.7,16.32 17.59,12.42 17.59,6.6 18.45,5.74 18.45,4.05 18.75,3.75 20.9,3.75 20.9,6.25 21.81,7.16 22.86,7.16 23.14,7.44 23.14,10.78 23.2,10.83 23.2,10.95 23.33,11.08 24.5,11.08 24.52,11.1 25,11.1 25,20.45 25.51,20.96 C13.1
LOUT
  Bottom 0.152: C3.2 20.92,9.93 20.16,10.7 20.16,13.88 20.15,13.88 20.15,14.55 20.1,14.6 IC4.12
N$1
  Bottom 0.152: R5.2 46.19,19.96 61,5.15 73.75,5.15 74.6,4.3 74.6,1.6 74.65,1.55 72.23,1.55 J_LIN.1
N$2
  Bottom 0.152: R13.2 91.04,11.84 90.28,11.08 90.28,5.81 90.66,5.43 93.17,5.43 95.05,3.55 95.05,2.31 94.05,1.3 77.34,1.3 75.97,2.68 J_LOUT.1
N$3
  Bottom 0.152: R12.2 78.51,4.88 J_ROUT.1
N$4
  Top 0.152: IC1.2 65.85,16.2 64.29,16.2 R18.2 62.95,15.83 R19.1
N$5
  Top 0.152: R22.1 63.47,10.97 R21.2 64.42,10.36 IC1.7
N$6
  Top 0.152: R24.1 74.42,10.87 R23.2 73.72,11.13 73.22,11.63 IC1.9
N$8
  Top 0.152: R20.1 61.77,15.12 60.65,16.24 60.65,18.45 60.92,18.72 61.6,18.72 | R19.2 61.52,18.64 61.6,18.72 | IC1.1 65.57,17.98 64.7,18.85 61.73,18.85 61.6,18.72
N$9
  Top 0.152: IC1.14 72.97,17.98 73.79,17.16 R26.2 74.33,19.19 R27.1
N$10
  Top 0.152: R31.1 79.24,11.81 79.78,12.36 80.33,12.36 80.64,12.67 80.64,13.7 R30.2 81.98,14.36 82.16,14.18 82.16,12.88 83.32,11.72 IC5.6
N$11
  Top 0.152: R25.1 76.08,9.34 R24.2 75.22,8.4 73.52,8.4 IC1.8
N$12
  Top 0.152: IC5.2 82.02,16.8 R28.2 80.28,16.47 R29.1
N$13
  Top 0.152: IC5.7 81.68,10.45 | 81.68,10.45 81.17,9.94 80.8,9.94 80.02,9.16 R32.1 | 81.68,10.45 R31.2
N$14
  Top 0.152: R37.1 94.89,16.66 R36.2 93.21,15.19 91.6,16.8 IC5.13
N$15
  Top 0.152: CVIN(100K)2.1 86.13,4.83 R40.1
  Bottom 0.152: C53.1 69.72,11.11 R58.1 70.26,11.65 IC10.9 72.1,11.91 72.42,11.91 73.12,12.62 73.12,15.37 69.65,18.84 68.4,18.84 68.01,19.23 68.01,19.77 69.53,21.3 81.41,21.3 81.53,21.41 83.08,21.41 83.08,8.5 83.08,5.14 85.33,2.89 CVIN(100K)2.1
N$16
  Top 0.152: IC5.1 83.93,18.07 82.65,19.35 79.81,19.35 R29.2 78.15,17.69 78.15,14.8 78.59,14.36 R30.1
N$17  (via drill 0.35)
  Top 0.152: R3.1 81.05,4.8 CVIN(100K)0.1 79.84,4.1 75.88,4.1 71.96,8.02 v71.32,8.02
  Bottom 0.152: C49.1 R46.1 78.89,14.25 IC10.2 76.68,14.24 76.42,13.98 76.42,10.44 76.34,10.36 73.3,10.36 71.32,8.38 v71.32,8.02
N$18
  Top 0.152: IC5.9 92.97,11.72 R34.2 93.14,9.86 R35.1
N$19
  Top 0.152: R39.1 83.59,4.99 CVIN(100K)1.1
  Bottom 0.152: IC10.6 78.4,11.65 78.74,11.31 R47.1 79.58,11.26 C50.1 82.46,10.48 82.46,8.96 82.35,8.85 82.35,4.13 CVIN(100K)1.1
N$20
  Top 0.152: IC5.14 91.38,18.07 92.13,17.32 R37.2 93.19,17.81 R38.1
N$21
  Top 0.152: CVIN(100K)3.1 88.67,4.82 R41.1
  Bottom 0.152: CVIN(100K)3.1 87.11,4.45 86.47,4.45 83.38,7.54 83.38,21.72 81.4,21.72 81.28,21.6 69.1,21.6 67.64,20.14 C54.1 69.63,15.94 R59.1 72.02,16.04 72.82,15.24 72.82,14.18 72.75,14.25 IC10.13
N$22
  Top 0.152: R21.1 61.77,11.9 R20.2 | R20.2 | IC1.6 65.08,11.63 64.95,11.5 63.46,12.99 R20.2
N$23
  Top 0.152: IC5.8 90.3,10.45 92.15,8.6 94.35,8.6 94.88,9.13 94.88,9.6 | 94.88,9.6 R35.2 | R36.1 94.91,13.71 94.1,12.9 94.05,12.9 94,12.85 94,10.3 94.7,9.6 94.88,9.6
N$24
  Top 0.152: R18.1 65.08,17.53 65.17,17.45 67.56,17.45 67.69,17.58 67.69,18.37 66.87,19.2 66.8,19.2 66.27,19.73 66.27,20.36 67.45,21.54 67.45,23.6 70.14,26.3 70.14,26.86 70.94,27.66 U$1.8
N$25
  Top 0.152: CVOUT1.1 91.21,1.71 90.56,1.06 59.94,1.06 59.5,1.5 59.5,5.5 63.22,9.22 R22.2
N$26
  Top 0.152: U$2.8 69.34,23.39 75.29,23.39 75.29,18.56 75.42,18.43 76.61,18.43 77.91,19.72 84.69,19.72 85.95,18.46 85.95,17.67 85.81,17.54 83.42,17.54 82.79,18.17 R28.1
N$27
  Top 0.152: CVOUT2.1 93.75,4.65 93.73,4.65 89.47,8.91 88.33,8.91 87.65,9.59 87.65,18.5 86.1,20.05 76.86,20.05 R27.2
N$28
  Top 0.152: R26.1 76.03,16.73 R25.2 72.74,16.71 IC1.13
N$29
  Top 0.152: CVOUT3.1 94.7,1.3 92.8,1.3 92.38,1.72 92.38,3.37 92.35,3.4 92.35,5.6 89.35,8.6 81.95,8.6 R32.2
N$31  (via drill 0.35)
  Top 0.152: v43.55,10 43.5,9.95 v40.2,9.95
  Bottom 0.152: J_RIN.1 73.4,2.92 73.4,4.84 60.87,4.84 55.72,10 v43.55,10 | v40.2,9.95 38.48,9.95 R4.2
N$32
  Bottom 0.152: R8.2 36.13,8.39 37.2,8.39 | R4.1 37.2,8.39 | IC2.2 31.85,13.45 32.1,13.7 33.9,13.7 37.2,10.39 37.2,8.39
N$33
  Bottom 0.152: 99.86,18.02 D1.+
  Bottom 0.254: P4.10 P4.9 99.86,18.21 99.86,18.02
N$34
  Top 0.152: R38.2 97.6,16.82 97.6,4.12 CVOUT4.1
N$36
  Bottom 0.152: R8.1 35.48,10.14 R14.2 33.12,10.81 IC2.1
N$37
  Bottom 0.152: C12.2 28.45,10.06 C9.2 28.67,10.14 R16.1 R14.1
N$40
  Bottom 0.152: IC2.6 30.58,17.91 31.15,18.48 31.23,18.48 R9.2 32.34,20.24 33.15,21.05 33.15,22.8 35.15,22.8 35.74,22.21 R5.1
N$42
  Bottom 0.152: R15.2 34.04,21.7 34.04,19.65 R9.1 34.04,18.69 34,18.65 32.8,18.65 31.85,17.7 IC2.7
N$43
  Bottom 0.152: Q1.2 8.27,19.86 C5.2 9.2,19.8 9.85,20.45 IC4.26
N$44
  Bottom 0.152: Q1.1 8.04,10.21 C4.2 8.1,17.7 8.2,17.8 8.4,17.8 9.6,19 9.6,19.4 10,19.8 IC4.25
N$45
  Bottom 0.152: C13.2 26.66,19.21 C10.2 R17.1 31.55,20.24 31.55,21.06 R15.1
N$46
  Bottom 0.152: IC3.1 88.87,13.52 R10.2 C7.1 89.9,8.62 89.9,1.65 80.14,1.65 79.8,1.99 79.8,6.3 79.5,6.6 R12.1
N$47
  Bottom 0.152: D1.- 97.84,14.7 F1.2
N$48
  Bottom 0.152: IC3.2 87.33,11.87 R10.1 87.17,9.66 C7.2 87.18,7.6 R6.2
N$49  (via drill 0.35)
  Top 0.152: v85.69,7.89 85.27,7.47 77.53,7.47 77.07,7.01 v77.07,5.37 | v60.21,7.14 59.54,7.14 57.26,4.86 v57.26,4.81
  Bottom 0.152: C2.1 24.75,8.14 25.64,9.04 27.33,9.04 27.47,8.9 27.47,7.73 28.05,7.15 54.9,7.15 57.24,4.81 v57.26,4.81 | v77.07,5.37 76.93,5.51 61.69,5.51 60.2,7 v60.2,7.13 v60.21,7.14 | R6.1 88.89,7.57 R1.1 88.56,5.54 87.78,4.76 86.59,4.76 86.09,5.25 86.09,7.48 v85.69,7.89
N$53
  Top 0.152: P4.2 P4.1
  Bottom 0.152: D2.-
  Bottom 0.254: P4.2 101.82,7.47 D2.-
N$54
  Bottom 0.152: C8.1 87.57,23.06 R11.2 87.33,20.73 IC3.7 87.4,18.55 87.4,15.9 87.55,15.75 R13.1
N$55
  Bottom 0.152: IC3.6 86.06,20.78 R11.1 85.87,23.06 C8.2 83.91,23.16 R7.2
N$56
  Bottom 0.152: C11.1 10.43,10.3 C14.1 10.32,11.28 9,12.6 9,13.6 9.35,13.95 IC4.16
N$57  (via drill 0.35)
  Top 0.152: v27.49,15.22 29.72,17.45 48.85,17.45 52.7,21.3 59.2,21.3 v59.25,21.25
  Bottom 0.152: R2.1 82.08,25.5 R7.1 80.78,22 60,22 v59.25,21.25 | C3.1 24.89,10.79 25.13,10.79 25.6,11.27 27.3,12.97 27.3,15.22 v27.49,15.22
N$59
  Bottom 0.152: D2.+ 98.64,10.88 F2.2
RIN
  Bottom 0.152: C12.1 26.25,7.92 26.25,6.5 26,6.25 23.85,6.25 23.45,5.85 23.45,3.2 16.05,3.2 15.82,3.43 15.82,5.58 17.14,6.9 17.14,12.2 15.19,14.15 15.06,14.28 13.44,15.9 IC4.19
ROUT
  Bottom 0.152: IC4.13 18.58,13.9 19.7,13.9 19.85,13.75 19.85,9.5 21.21,8.14 C2.2
SPI_CLK
  Top 0.152: MS2.11 34.51,7.14 55.24,7.14 55.4,7.3 55.4,13.75 56.9,15.25 57.83,15.25 U2.11 59.13,15.28 59.4,15.54 59.4,19.7 61.64,21.94 U$2.3 65.58,21.94 66.15,22.52 66.15,26.35 66.16,26.36 U$1.3
SPI_MISO
  Top 0.152: U2.10 56.96,14.01 56,13.05 56,11.92 55.9,11.82 55.9,6.5 38.96,6.5 MS2.13
SPI_MOSI
  Top 0.152: 65.09,21.41 65.16,21.47 65.75,21.47 66.63,22.34 66.63,25.01 U$1.4 | 65.09,21.41 U$2.4 | 65.09,21.41 61.76,21.41 59.75,19.4 59.75,13.2 59.29,12.74 U2.9 57.53,12.74 56.63,11.84 56.3,11.5 56.3,3.6 35.15,3.6 34.89,3.86 MS2.12